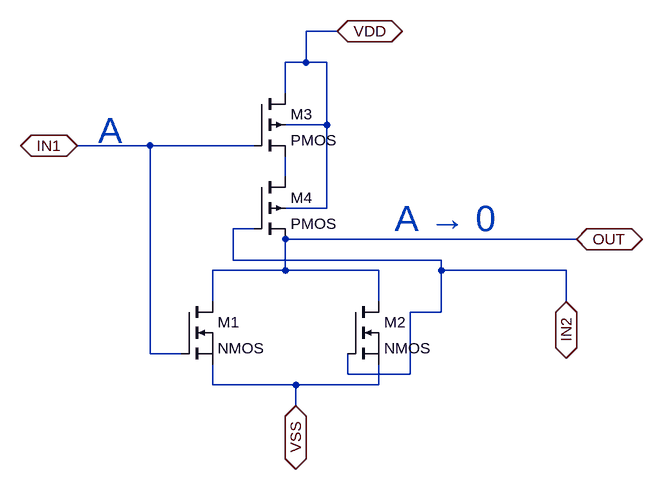
[diagram p0: schematic notgateimply.asc]
notgateimply.asc, the LTspice schematic file:
Version 4
SHEET 1 880 680
WIRE 208 -176 160 -176
WIRE 160 -128 160 -176
WIRE 160 -128 128 -128
WIRE 192 -128 160 -128
WIRE 128 -80 128 -128
WIRE 192 -32 192 -128
WIRE 192 -32 128 -32
WIRE -80 0 -192 0
WIRE 80 0 -80 0
WIRE 128 48 128 16
WIRE 192 96 192 -32
WIRE 192 96 128 96
WIRE 80 128 48 128
WIRE 576 144 128 144
WIRE 48 176 48 128
WIRE 368 176 48 176
WIRE 128 192 128 144
WIRE 128 192 16 192
WIRE 272 192 128 192
WIRE 368 192 368 176
WIRE 560 192 368 192
WIRE 16 240 16 192
WIRE 272 240 272 192
WIRE 560 240 560 192
WIRE 368 256 368 192
WIRE 368 256 320 256
WIRE -80 320 -80 0
WIRE -32 320 -80 320
WIRE 224 352 224 320
WIRE 320 352 320 256
WIRE 320 352 224 352
WIRE 16 368 16 336
WIRE 144 368 16 368
WIRE 272 368 272 336
WIRE 272 368 144 368
WIRE 144 400 144 368
FLAG -192 0 IN1
IOPIN -192 0 BiDir
FLAG 560 240 IN2
IOPIN 560 240 BiDir
FLAG 576 144 OUT
IOPIN 576 144 BiDir
FLAG 208 -176 VDD
IOPIN 208 -176 BiDir
FLAG 144 400 VSS
IOPIN 144 400 BiDir
SYMBOL nmos -32 240 R0
SYMATTR InstName M1
SYMBOL nmos 224 240 R0
SYMATTR InstName M2
SYMBOL pmos4 80 -80 R0
SYMATTR InstName M3
SYMBOL pmos4 80 48 R0
SYMATTR InstName M4
TEXT -160 -24 Left 5 ;A
TEXT 296 112 Left 5 ;A → 0

The netlist it stands for:
* notgateimply.asc
M1 OUT IN1 VSS VSS NMOS
M2 OUT IN2 VSS VSS NMOS
M3 VDD IN1 N001 VDD PMOS
M4 N001 IN2 OUT VDD PMOS
.model NMOS NMOS
.model PMOS PMOS
.lib standard.mos
* A
* A → 0
.backanno
.end